# Altium schematic sheet Kido_test.SchDoc
size A4; SheetNumber: 1; SheetTotal: 1
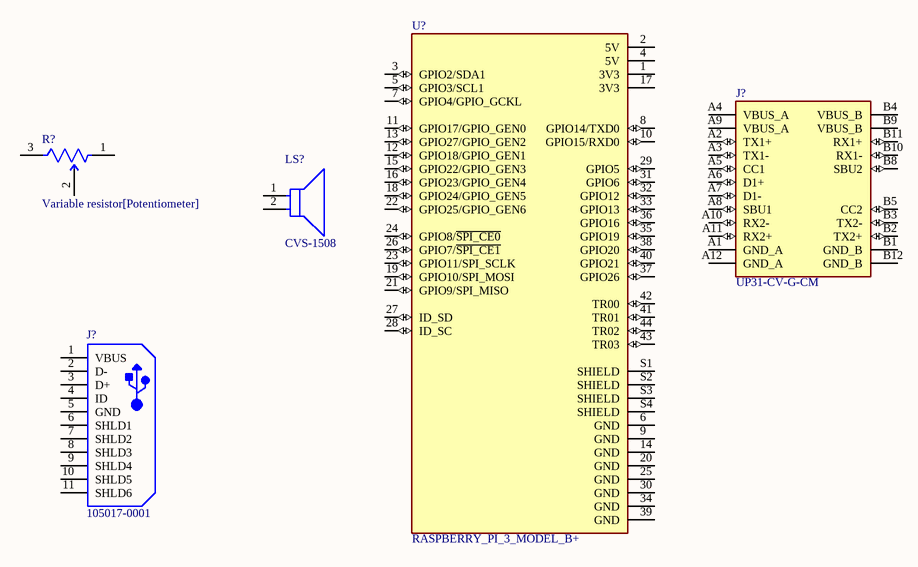
[diagram p0: Kido_test.SchDoc]

## Parts
(Parts that share a designator on the sheet are numbered #1, #2 ... from top to bottom, then left to right.)
J?#1  UP31-CV-G-CM  [CUI_UP31-CV-G-CM]
J?#2  105017-0001  [USB-MICRO-B_V]
LS?  CVS-1508  [FP-CVS-1508-MFG]
R?  Variable resistor[Potentiometer]  [FP-3310R-MFG]
U?  RASPBERRY_PI_3_MODEL_B+  [MODULE_RASPBERRY_PI_3_MODEL_B+]

## Nets

Not connected (* = marked no-connect by the designer): J?#1 A1(GND_A) A2(TX1+) A3(TX1-) A4(VBUS_A) A5(CC1) A6(D1+) A7(D1-) A8(SBU1) A9(VBUS_A) A10(RX2-) A11(RX2+) A12(GND_A) B1(GND_B) B2(TX2+) B3(TX2-) B4(VBUS_B) B5(CC2) B8(SBU2) B9(VBUS_B) B10(RX1-) B11(RX1+) B12(GND_B); J?#2 1(VBUS) 2(D-) 3(D+) 4(ID) 5(GND) 6(SHLD1) 7(SHLD2) 8(SHLD3) 9(SHLD4) 10(SHLD5) 11(SHLD6); LS? 1(C) 2(A); R? 1(CCW) 2 3(CW); U? 1(3V3) 2(5V) 3(GPIO2/SDA1) 4(5V) 5(GPIO3/SCL1) 6(GND) 7(GPIO4/GPIO_GCKL) 8(GPIO14/TXD0) 9(GND) 10(GPIO15/RXD0) 11(GPIO17/GPIO_GEN0) 12(GPIO18/GPIO_GEN1) 13(GPIO27/GPIO_GEN2) 14(GND) 15(GPIO22/GPIO_GEN3) 16(GPIO23/GPIO_GEN4) 17(3V3) 18(GPIO24/GPIO_GEN5) 19(GPIO10/SPI_MOSI) 20(GND) 21(GPIO9/SPI_MISO) 22(GPIO25/GPIO_GEN6) 23(GPIO11/SPI_SCLK) 24(GPIO8/~{SPI_CE0}) 25(GND) 26(GPIO7/~{SPI_CE1}) 27(ID_SD) 28(ID_SC) 29(GPIO5) 30(GND) 31(GPIO6) 32(GPIO12) 33(GPIO13) 34(GND) 35(GPIO19) 36(GPIO16) 37(GPIO26) 38(GPIO20) 39(GND) 40(GPIO21) 41(TR01) 42(TR00) 43(TR03) 44(TR02) S1(SHIELD) S2(SHIELD) S3(SHIELD) S4(SHIELD)

## Library data of the parts
J?#1 = UP31-CV-G-CM: Type C, USB 3.1 Gen 2, 5 A, Vertical, Cable Mount, USB Plug Connector; MF: CUI Devices; Check_prices: https://www.snapeda.com/parts/UP31-CV-G-CM/CUI%20Devices/view-part/2768202/?ref=eda; Package: None; CUI_purchase_URL: https://www.cuidevices.com/product/interconnect/connectors/usb-connectors/up31-cv-g-cm?utm_source=snapeda.com&utm_medium=referral&utm_campaign=snapedaBOM; Value: *; MP: UP31-CV-G-CM; Price: None; Availability: In Stock; SnapEDA_Link: https://www.snapeda.com/parts/UP31-CV-G-CM/CUI%20Devices/view-part/2768202/?ref=snap; Purchase-URL: https://pricing.snapeda.com/search/part/UP31-CV-G-CM/?ref=eda
J?#2 = CMP-2000-05827-1: Micro-USB B Receptacle, Right Angle, Bottom Mount, Surface Mount, with Solder Tabs, -30 to 85 degC, 5-Pin USB, RoHS, Tape and Reel; Manufacturer: Molex; Featured Product: Micro-USBConnectorsUSBConnectors; Other Names: WM1399DKR; Package Version: Rev. F, 12/2012; Number of Contacts: 5; Connector Type: USB-microB; Catalog Drawings: 1050170001; 3D Model: 105017-0001.stp; Mating Products: WM17145-ND-CABLEMICROUSBBTOSTDA1.0MWM17147-ND-CABLEMICROUSBBTOSTDA2.0MWM17146-ND-CABLEMICROUSBBTOSTDA1.5M; PCN Assembly/Origin: ResinSupplier21/Oct/2015; Voltage - Max: 30V; Online Catalog: Molex-MicroUSB; Manufacturer URL: http://www.molex.com/; Package Description: 5-Leads USB, Micro B, Body 7.5 x 5 mm, Pitch 0.65 mm; Datasheet URL: http://www.molex.com/elqNow/elqRedir.htm?ref=http://www.molex.com/webdocs/datasheets/pdf/en-us/1050170001_IO_CONNECTORS.pdf; Ingress Protection: -; Datasheet Version: 03/2016; Mounting Type: BoardCutout,SurfaceMount,RightAngle; Circuits: 5; Standard Package: 1; Package Reference: MICRO-B; Package URL: http://www.molex.com/pdm_docs/sd/1050170001_sd.pdf; Category: Connectors,Interconnects; Series: -; RoHS Information: 1050170001CertofCompliance; Features: Shielded,SolderRetention; Family: USB,DVI,HDMIConnectors; Specifications: -; Gender: Receptacle; Packaging: Digi-Reel®; Mounting Technology: SurfaceMount
LS? = CMP-14846-000001-1: SPEAKER 8OHM 300MW TOP PORT 87DB; Manufacturer: CUI Inc; Resistance: 8Ω; Value: 8Ω; Frequency: 1700Hz; Description: CVS Seies 15 mm round 7.5 mm deep Mylar 300 mW 8 Ohm 1.7 kHz PCB mount Speaker; Package: CVS-1508; Device Class L1: Electromechanical; Manufacturer Part Number: CVS-1508; Mouser Description: Speakers & Transducers Speakers; Temperature Range High: +55°C; Octopart: https://octopart.com/cvs-1508-cui-21325683; Device Class L2: Audio Products; Temperature Range Low: -20°C; Category: Speak; Digikey Description: SPEAKER 8OHM 300MW TOP PORT 87DB; Temperature: -20°C to +55°C; Height: 8mm; ComponentLink2Description: Datasheet; ComponentLink2URL: https://www.cui.com/product/resource/cvs-1508.pdf; Device Class L3: Speakers; Lead Free: Yes; RoHS: TRUE; Automotive: No
R? = CMP-07234-000023-1: POT 10K OHM 1/4W PLASTIC LINEAR; Resistance: 10kR; Max Power Dissipation: 250mW; Temperature Coefficient: 1000ppm/°C; Actuator Length: 0.22inch; Tolerance: 20%; Actuator Diameter: 0.125inch; Number of Turns: 1; Type: Potentiometer; Taper: Linear; Max Operating Temperature: 125°C; Package Quantity: 50; Packaging: Bulk; Composition: Conductive Plastic; REACH SVHC: No SVHC; Contact Plating: Tin; Number of Gangs: 1; Weight: 4.5g; Mount: Through Hole; Min Operating Temperature: -40°C; Termination: Pin; Power Rating: 250mW
U? = RASPBERRY_PI_3_MODEL_B+: Case Plastic, ABS Black Hand Held, Split Sides 3.520 L x 2.740 W (89.41mm x 69.60mm) X 0.980 (24.89mm); MF: Raspberry Pi; MP: RASPBERRY PI 3 MODEL B+; Purchase-URL: https://pricing.snapeda.com/search/part/RASPBERRY PI 3 MODEL B+/?ref=eda; Check_prices: https://www.snapeda.com/parts/RASPBERRY%20PI%203%20MODEL%20B+/Raspberry+Pi/view-part/?ref=eda; SnapEDA_Link: https://www.snapeda.com/parts/RASPBERRY%20PI%203%20MODEL%20B+/Raspberry+Pi/view-part/?ref=snap; Price: None; Availability: In Stock; Package: Raspberry Pi; Value: *